# EasyEDA schematic schem.json
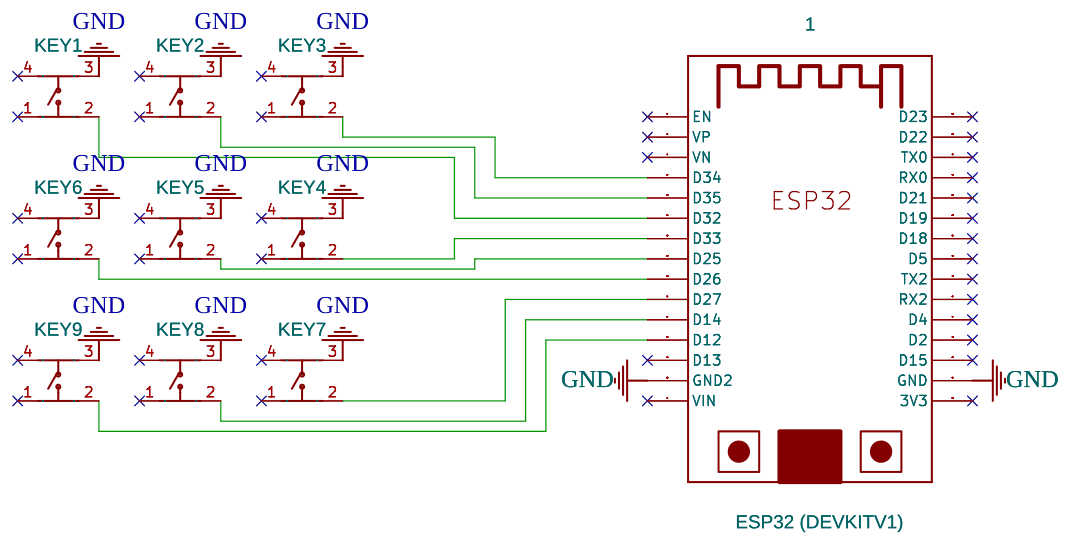
[diagram p0: schematic sheet]

## Parts
1  ESP32 (DEVKITV1)  [ESP32-DEVKITV1_ESP32-DEVKITV1]
KEY1  K2-1841SP  [KEY-SMD_4P-L12.0-W12.0-P5.00-LS15.0]
KEY2  K2-1841SP  [KEY-SMD_4P-L12.0-W12.0-P5.00-LS15.0]
KEY3  K2-1841SP  [KEY-SMD_4P-L12.0-W12.0-P5.00-LS15.0]
KEY4  K2-1841SP  [KEY-SMD_4P-L12.0-W12.0-P5.00-LS15.0]
KEY5  K2-1841SP  [KEY-SMD_4P-L12.0-W12.0-P5.00-LS15.0]
KEY6  K2-1841SP  [KEY-SMD_4P-L12.0-W12.0-P5.00-LS15.0]
KEY7  K2-1841SP  [KEY-SMD_4P-L12.0-W12.0-P5.00-LS15.0]
KEY8  K2-1841SP  [KEY-SMD_4P-L12.0-W12.0-P5.00-LS15.0]
KEY9  K2-1841SP  [KEY-SMD_4P-L12.0-W12.0-P5.00-LS15.0]

## Library data of the parts
1 = ESP32-DEVKIT-V1-30PIN: Contributor: rully.anggraini99
KEY1-KEY9 = K2-1841SP: Supplier: LCSC; Manufacturer: 韩国韩荣; Manufacturer Part: K2-1841SP-H4SW-02; Supplier Part: C83214; JLCPCB Part Class: Extended Part

## Nets
GND: 1.GND 1.GND2 KEY1.3 KEY2.3 KEY3.3 KEY4.3 KEY5.3 KEY6.3 KEY7.3 KEY8.3 KEY9.3
Net-(1-D12): 1.D12 KEY9.2
Net-(1-D14): 1.D14 KEY8.2
Net-(1-D25): 1.D25 KEY5.2
Net-(1-D26): 1.D26 KEY6.2
Net-(1-D27): 1.D27 KEY7.2
Net-(1-D32): 1.D32 KEY1.2
Net-(1-D33): 1.D33 KEY4.2
Net-(1-D34): 1.D34 KEY3.2
Net-(1-D35): 1.D35 KEY2.2

Not connected (* = marked no-connect by the designer): 1 3V3* D2* D4* D5* D13* D15* D18* D19* D21* D22* D23* EN* RX0* RX2* TX0* TX2* VIN* VN* VP*; KEY1 1* 4*; KEY2 1* 4*; KEY3 1* 4*; KEY4 1* 4*; KEY5 1* 4*; KEY6 1* 4*; KEY7 1* 4*; KEY8 1* 4*; KEY9 1* 4*
